# Altium schematic sheet Power.SchDoc
size Letter; SheetNumber: 2; SheetTotal: 2
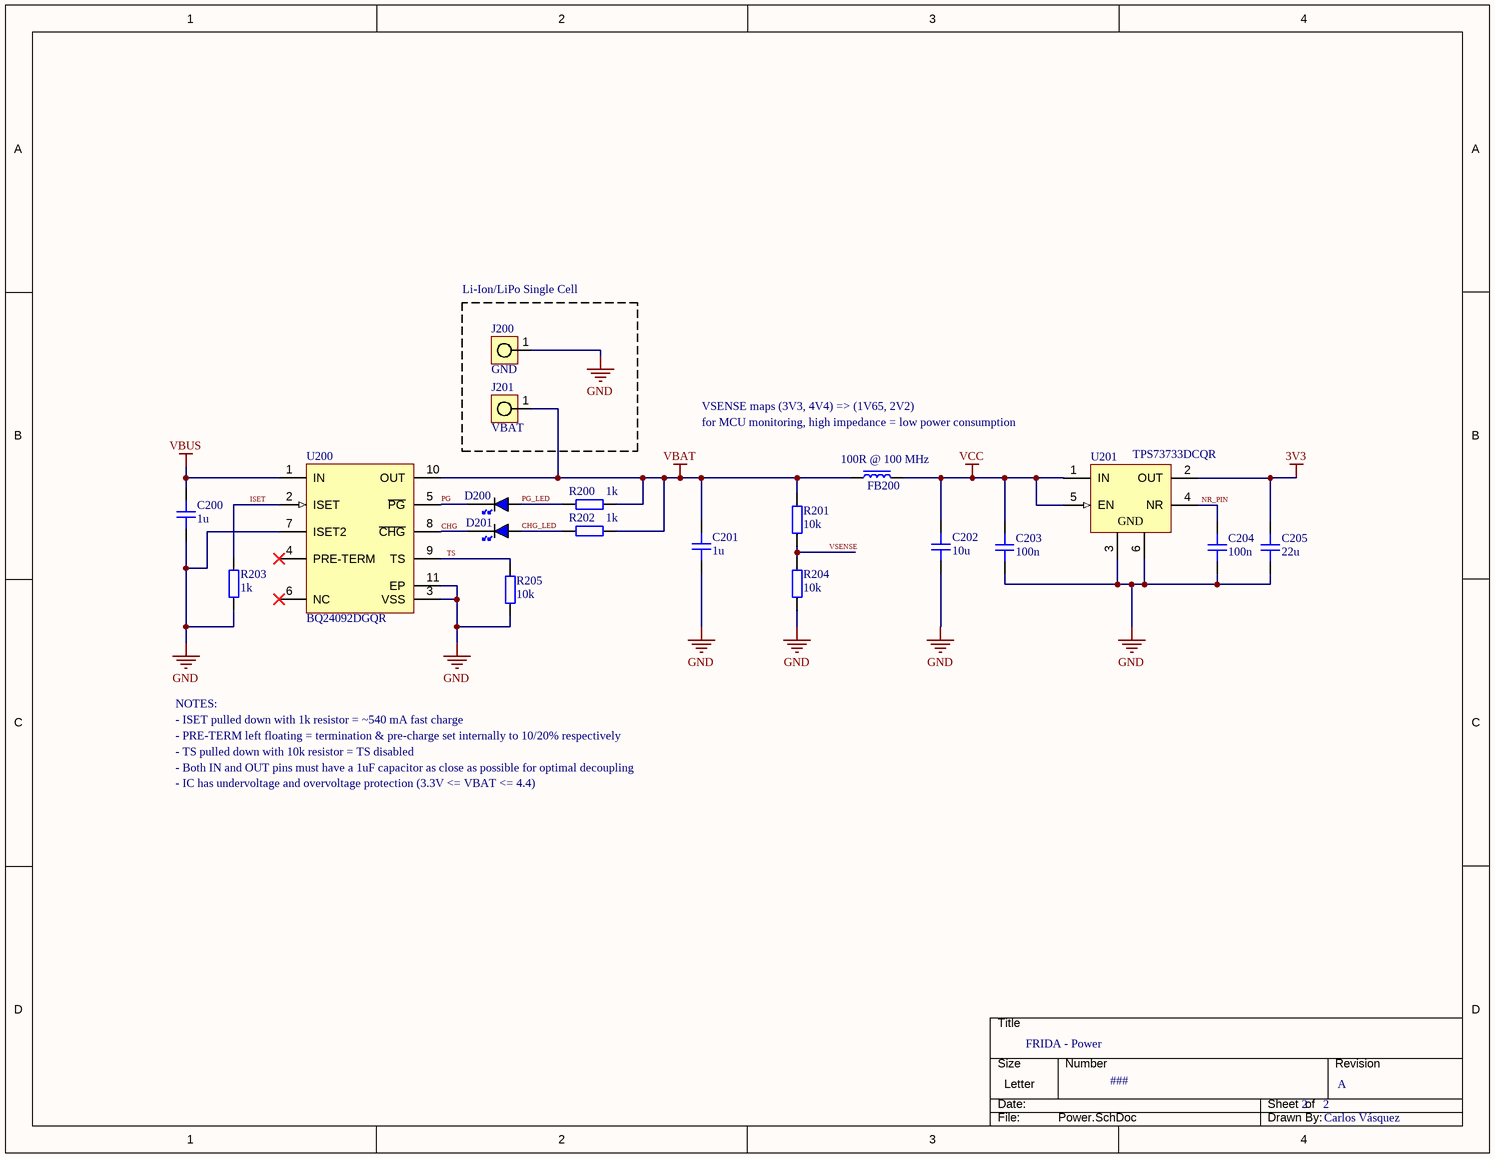
[diagram p0: Power.SchDoc]

## Parts
C200  1u  [CAP_0402]
C201  1u  [CAP_0402]
C202  10u  [CAP_0805]
C203  100n  [CAP_0603]
C204  100n  [CAP_0603]
C205  22u  [CAP_0603]
D200  BLUE  [LED_0805_BLUE]  (value not drawn)
D201  BLUE  [LED_0805_BLUE]  (value not drawn)
FB200  100R @ 100 MHz  [FB_0805]
J200  GND  [SOLDER_PIN_THT_1_5]
J201  VBAT  [SOLDER_PIN_THT_1_5]
R200  1k  [RES_0402]
R201  10k  [RES_0402]
R202  1k  [RES_0402]
R203  1k  [RES_0402]
R204  10k  [RES_0402]
R205  10k  [RES_0402]
U200  BQ24092DGQR  [DGQ0010D_L]
U201  TPS73733DCQR  [DCQ0006A_N]

## Blocks framed on the sheet
Li-Ion/LiPo Single Cell: J200 J201

## Nets
3V3: C205.2 U201.2(OUT)
GND: C200.1 C201.1 C202.1 C203.1 C204.1 C205.1 J200.1 R203.2 R204.1 R205.1 U200.3(VSS) U200.7(ISET2) U200.11(EP) U201.3(GND) U201.6(GND)
VBAT: C201.2 FB200.1 J201.1 R200.1 R201.2 R202.1 U200.10(OUT)
VBUS: C200.2 U200.1(IN)
VCC: C202.2 C203.2 FB200.2 U201.1(IN) U201.5(EN)
CHG: D201.K U200.8(~{CHG})
CHG_LED: D201.A R202.2
ISET: R203.1 U200.2(ISET)
NR_PIN: C204.2 U201.4(NR)
PG: D200.K U200.5(~{PG})
PG_LED: D200.A R200.2
TS: R205.2 U200.9(TS)
VSENSE: R201.1 R204.2

Not connected (* = marked no-connect by the designer): U200 4(PRE-TERM)* 6(NC)*

## Notes on the sheet
- VSENSE maps (3V3, 4V4) => (1V65, 2V2)
- for MCU monitoring, high impedance = low power consumption
- NOTES:
- - ISET pulled down with 1k resistor = ~540 mA fast charge
- - PRE-TERM left floating = termination & pre-charge set internally to 10/20% respectively
- - TS pulled down with 10k resistor = TS disabled
- - Both IN and OUT pins must have a 1uF capacitor as close as possible for optimal decoupling
- - IC has undervoltage and overvoltage protection (3.3V <= VBAT <= 4.4)
- FRIDA - Power
- ###
- 2
- A
- Carlos Vásquez
- DWG. NO.
- REV.
- SHT.
- REVISION
- DESCRIPTION
- DATE
- APPROVED
- THIS DOCUMENT AND THE DATA DISCLOSED HEREIN OR HEREWITH IS THE PROPERTY OF ALTIUM LIMITED AND MAY BE FREELY DISTRIBUTED IN WHOLE. NO RIGHTS ARE RESERVED OR EXPRESS OR IMPLIED WARANTEE GIVEN.
- ENG:
- DSN:
- APPROVALS
- PROJECT
- DOCUMENT REVISION:
- DESIGN ITEM:
- CHK:
- BOM:
- REFERENCE DOCUMENTS
- PROJECT REVISION:
- TITLE
- FAB DWG:
- PCB DWG:
- ASSY DWG:
- SCALE:
- SIZE
- C
- CAGE CODE
- FILE NAME
- DWG NO.
- SHEET
- OF
- REV

## Library data of the parts
C200 C201 = CAP_0402: Capacitor SMD 0402; Manufacturer: *; Manufacturer Part Number: *; Distributor Link: *; LCSC: *; Rating: *; Dielectric: *
C202 = CAP_0805: Capacitor SMD 0805; Manufacturer: *; Manufacturer Part Number: *; Distributor Link: *; LCSC: *; Rating: *; Dielectric: *
C203-C205 = CAP_0603: Capacitor SMD 0603; Manufacturer: *; Manufacturer Part Number: *; Distributor Link: *; LCSC: *; Rating: *; Dielectric: *
D200 D201 = LED_0805_BLUE: LED 0805 BLUE SMD; Manufacturer: *; Manufacturer Part Number: *; Distributor Link: *; LCSC: *
FB200 = FB_0805: Ferrite Bead SMD 0805; Manufacturer: *; Manufacturer Part Number: *; Distributor Link: *; LCSC: *
J200 J201 = SOLDER_PIN_THT: Solder Pin 1.5mm Through-Hole
R200-R205 = RES_0402: Resistor SMD 0402; Manufacturer: *; Manufacturer Part Number: *; Distributor Link: *; LCSC: *
U200 = CMP-0321-00900-2: 1 A, Single-Input, Single-Cell Li-Ion Battery Charger with Operation Over JEITA and 10 k ohm NTC, 4.5 V, -40 to 150 degC, 10-pin MSOP-PowerPAD (DGQ), Green (RoHS & no Sb/Br); Manufacturer: Texas Instruments; Li-Ion: N; SubFamily: Battery Charge Management; Vin(Min)(V): 4.5; PackageReference: DGQ0010D; Code_JEDEC: MO-187-BA-T; PackageDescription: 10-Pin PowerPAD Plastic Small Outline 0.5 mm Pitch, Exposed Pad; Lead Acid: N; ComponentLink1URL: http://www.ti.com/general/docs/lit/getliterature.tsp?genericPartNumber=BQ24092&fileType=pdf; PartNumber: BQ24092DGQR; PackageVersion: revF, Nov-2011; Li-Polymer: N; NiMH: N; NiCd: N; Eco-Plan: Green (RoHS & no Sb/Br); Over Voltage Protection: N; DatasheetVersion: SLUS968C; ComponentLink1Description: Datasheet; Mounting Technology: Surface Mount
U201 = CMP-0395-00300-2: Single Output LDO, 1 A, Fixed 3.3 V Output, 2.2 to 5.5 V Input, with Reverse Current Protection, 6-pin SOT-223 (DCQ), -40 to 125 degC, Green (RoHS & no Sb/Br); Manufacturer: Texas Instruments; Fixed Output Options(V): 3.3; Vdo(Typ)(mV): 130; Iout(Max)(A): 1; Accuracy(%): 3; SubFamily: Single Channel LDO; Vin(Min)(V): 2.2; Vin(Max)(V): 5.5; Rating: Catalog; Iq(Typ)(mA): 0.3; PartNumber: TPS73733DCQR; DatasheetVersion: SBVS067O; PackageReference: DCQ0006A; ComponentLink3URL: http://www.ti.com/litv/pdf/mpds098c; ComponentLink2Description: Datasheet; PackageDescription: 6-Pin Plastic Small Outline, Body 3.5 x 6.5 mm, Pitch 1.27 mm; ComponentLink2URL: http://www.ti.com/general/docs/lit/getliterature.tsp?genericPartNumber=TPS73733&fileType=pdf; PackageVersion: 4202109/D; Vout Adj(Min)(V): 3.3; Vout Adj(Max)(V): 3.3; Eco-Plan: Green (RoHS & no Sb/Br); ComponentLink3Description: Package Specification; Mounting Technology: Surface Mount; ComponentLink1URL: http://www.ti.com/; ComponentLink1Description: Manufacturer URL